# EAGLE design OGX360I-2CH - USB PCB (EAGLE 9.6.2)
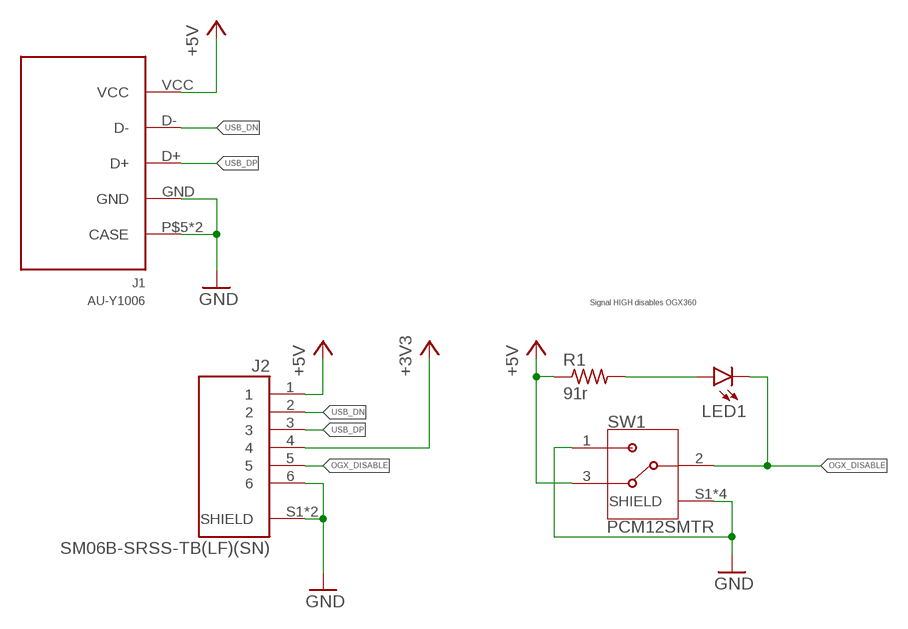
[diagram p0: schematic, sheet 1]

## Parts
J1  AU-Y1006  [USBA_SMD]
J2  SM06B-SRSS-TB(LF)(SN)  [JST_SM06B-SRSS-TB(LF)(SN)]
LED1  LEDCHIP-LED0805  [CHIP-LED0805]
R1  91r  R-US_R0805  [R0805]
SW1  PCM12SMTR  [SW_PCM12SMTR]

## Nets
+3V3: J2.4
+5V: J1.VCC J2.1 R1.1 SW1.3
GND: J1.GND J1.P$5(CASE) J1.P$6(CASE) J2.6 J2.S1(SHIELD) J2.S2(SHIELD) SW1.1 SW1.S1(SHIELD) SW1.S2(SHIELD) SW1.S3(SHIELD) SW1.S4(SHIELD)
N$1: LED1.A R1.2
OGX_DISABLE: J2.5 LED1.C SW1.2
USB_DN: J1.D- J2.2
USB_DP: J1.D+ J2.3

## Notes on the sheet
- Signal HIGH disables OGX360

## Library data of the parts
J1 = AU-Y1006:AU-Y1006: USB - A USB 1.1 Receptacle Connector 4 Position Surface Mount, Right Angle; AVAILABILITY: Unavailable; DESCRIPTION: USB-A _USB TYPE-A_ USB 2.0 Receptacle Connector 4 Position Surface Mount, Right Angle; MF: Assmann WSW; MP: AU-Y1006; PACKAGE: None; PRICE: None
J2 = SM06B-SRSS-TB_LF__SN_:SM06B-SRSS-TB(LF)(SN): SH Series 6 Position 1 mm Surface Mount Right Angle Side Entry Shrouded Header; DESCRIPTION: Connector Header Surface Mount, Right Angle 6 position 0.039 _1.00mm_; DIGI-KEY_PART_NUMBER: 455-1806-1-ND; DIGI-KEY_PURCHASE_URL: https://www.digikey.com/product-detail/en/jst-sales-america-inc/SM06B-SRSS-TB_LF__SN_/455-1806-1-ND/926877?utm_source=snapeda&utm_medium=aggregator&utm_campaign=symbol; MF: JST Sales; MP: SM06B-SRSS-TB_LF__SN_; PACKAGE: None
LED1 = led:LED: LED OSRAM: - CHIPLED LG R971, LG N971, LY N971, LG Q971, LY Q971, LO R971, LY R971 LH N974, LH R974 LS Q976, LO Q976, LY Q976 LO Q996 - Hyper CHIPLED LW Q18S LB Q993, LB Q99A, LB R99A - SideLED LS A670, LO A670, LY A670, LG A670, LP A670 LB A673, LV A673, LT A673, LW A673 LH A674 LY A675 LS A676, LA A676, LO A676, LY A676, LW A676 LS A679, LY A679, LG A679 - Hyper Micro SIDELED® LS Y876, LA Y876, LO Y876, LY Y876 LT Y87S - SmartLED LW L88C, LW L88S LB L89C, LB L89S, LG L890 LS L89K, LO L89K, LY L89K LS L896, LA L896, LO L896, LY L896 - TOPLED LS T670, LO T670, LY T670, LG T670, LP T670 LSG T670, LSP T670, LSY T670, LOP T670, LYG T670 LG T671, LOG T671, LSG T671 LB T673, LV T673, LT T673, LW T673 LH T674 LS T676, LA T676, LO T676, LY T676, LB T676, LH T676, LSB T676, LW T676 LB T67C, LV T67C, LT T67C, LS T67K, LO T67K, LY T67K, LW E67C LS E67B, LA E67B, LO E67B, LY E67B, LB E67C, LV E67C, LT E67C LW T67C LS T679, LY T679, LG T679 LS T770, LO T770, LY T770, LG T770, LP T770 LB T773, LV T773, LT T773, LW T773 LH T774 LS E675, LA E675, LY E675, LS T675 LS T776, LA T776, LO T776, LY T776, LB T776 LHGB T686 LT T68C, LB T68C - Hyper Mini TOPLED® LB M676 - Mini TOPLED Santana® LG M470 LS M47K, LO M47K, LY M47K Source: http://www.osram.convergy.de LUXEON: - LUMILED® LXK2-PW12-R00, LXK2-PW12-S00, LXK2-PW14-U00, LXK2-PW14-V00 LXK2-PM12-R00, LXK2-PM12-S00, LXK2-PM14-U00 LXK2-PE12-Q00, LXK2-PE12-R00, LXK2-PE12-S00, LXK2-PE14-T00, LXK2-PE14-U00 LXK2-PB12-K00, LXK2-PB12-L00, LXK2-PB12-M00, LXK2-PB14-N00, LXK2-PB14-P00, LXK2-PB14-Q00 LXK2-PR12-L00, LXK2-PR12-M00, LXK2-PR14-Q00, LXK2-PR14-R00 LXK2-PD12-Q00, LXK2-PD12-R00, LXK2-PD12-S00 LXK2-PH12-R00, LXK2-PH12-S00 LXK2-PL12-P00, LXK2-PL12-Q00, LXK2-PL12-R00 Source: www.luxeon.com KINGBRIGHT: KA-3528ASYC Source: www.kingbright.com
R1 = rcl:R-US_: RESISTOR, American symbol; SPICEPREFIX: R
SW1 = PCM12SMTR:PCM12SMTR: Switch Slide ON ON SPDT Side Slide 0.3A 6VDC 10000Cycles Gull Wing SMD T/R; DESCRIPTION: Slide Switch SPDT Surface Mount, Right Angle; DIGI-KEY_PART_NUMBER: 401-2016-1-ND; DIGI-KEY_PURCHASE_URL: https://www.digikey.com/product-detail/en/c-k/PCM12SMTR/401-2016-1-ND/1640125?utm_source=snapeda&utm_medium=aggregator&utm_campaign=symbol; MF: C&K; MP: PCM12SMTR; PACKAGE: DO-201 C&amp;K Components

## Board
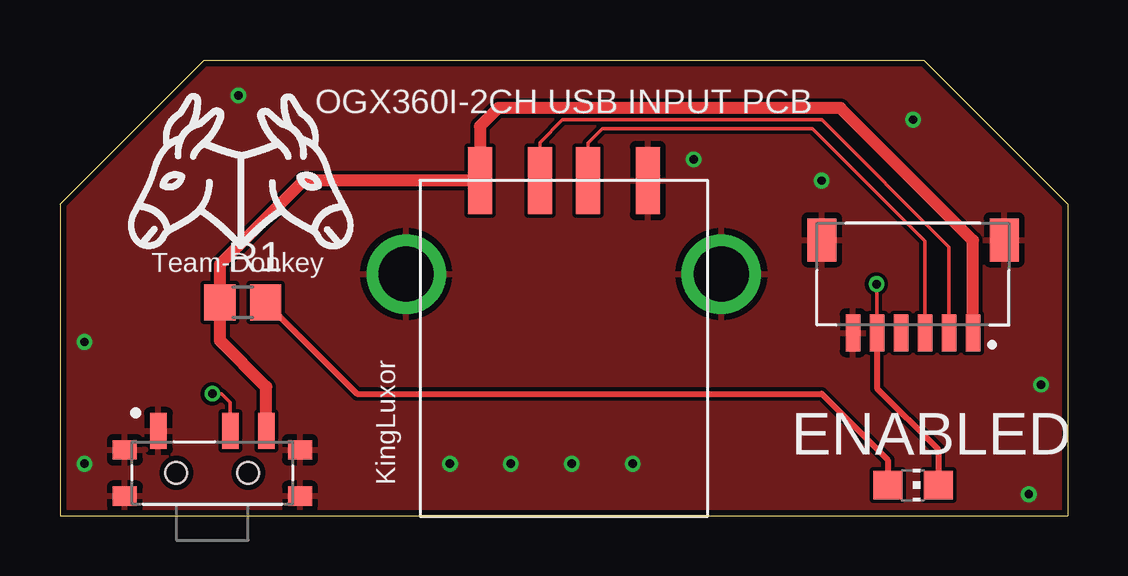
[diagram p1: board, top side]
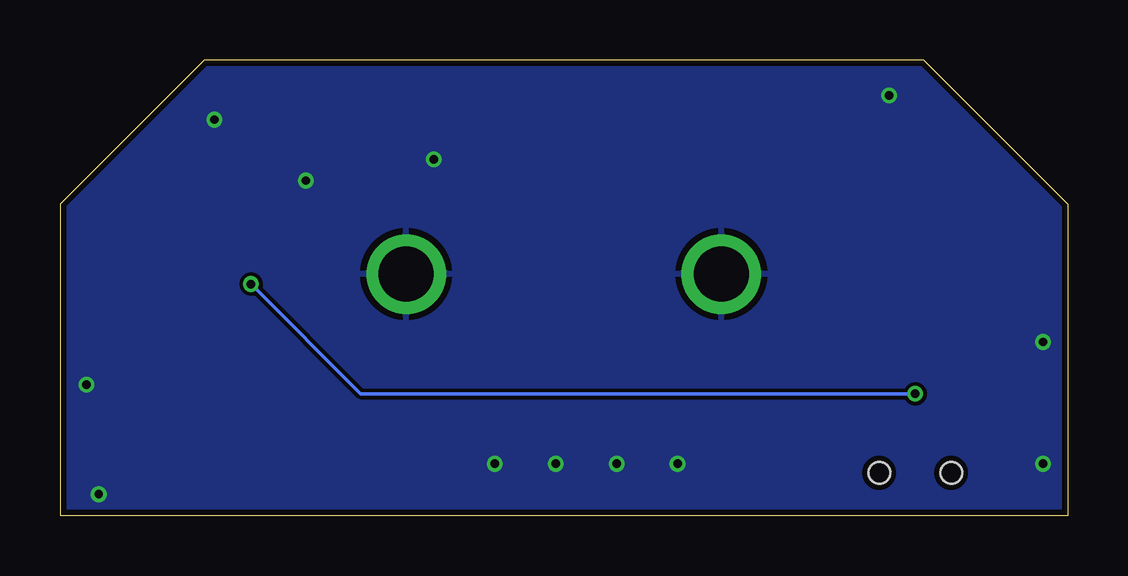
[diagram p2: board, bottom side, seen from below]

Size 42 x 19 mm. Coordinates in mm from the lower left corner, seen from the top.
Outline: 0,0 42,0 42,13 36,19 6,19 0,13 0,0
Copper layers (1*16): Top 0.035mm / dielectric 0.15mm / Bottom 0.035mm
Design rules "default": minimum track width 6mil, minimum drill 12mil, track to track 6mil, track to pad 6mil, pad to pad 6mil, via to via 6mil, smd to smd 0mil, copper to edge 10mil, drill to drill 10mil, minimum pad ring 10mil, minimum via ring 6mil, stop-mask expansion 2mil, vias tented up to drill 100mil, thermal gap 10mil

### Footprints (pad centres in the part's own frame; a part is rotated, then mirrored left to right if it is on the bottom)
USBA_SMD = smd 1 x 2.8: D+ 1,0; D- -1,0; GND 3.5,0; VCC -3.5,0 | drill 2.3: P$5 6.57,-3.9; P$6 -6.57,-3.9
JST_SM06B-SRSS-TB(LF)(SN) = smd 0.6 x 1.55: 1 -2.5,0; 2 -1.5,0; 3 -0.5,0; 4 0.5,0; 5 1.5,0; 6 2.5,0 | smd 1.2 x 1.8: S1 -3.8,-3.875; S2 3.8,-3.875
CHIP-LED0805 = smd 1.2 x 1.2: A 0,-1.05; C 0,1.05
R0805 = smd 1.3 x 1.5: 1 -0.95,0; 2 0.95,0
SW_PCM12SMTR = smd 0.7 x 1.5: 1 -2.25,1.75; 2 0.75,1.75; 3 2.25,1.75 | smd 1 x 0.8: S1 -3.65,0.965; S2 -3.65,-0.965; S3 3.65,-0.965; S4 3.65,0.965 | hole 0.9: -1.5,0; 1.5,0

### Placement (x,y rotation side)
J1  21,13.97 0 top
J2  35.56,7.62 180 top
LED1  35.56,1.27 270 top
R1  7.62,8.89 0 top
SW1  6.35,1.78 0 top

### Tracks (layer width: path | path; a pad name or v marks a point on that pad's centre or on a via)
+5V
  Top 0.508: J2.1 38.06,11.47 32.54,16.99 18.26,16.99 17.5,16.23 J1.VCC 10.16,13.97 6.67,10.48 R1.1 6.67,7.3 8.6,5.37 SW1.3
GND  (via drill 0.35)
  other vias: 7.44,17.53 35.56,16.51 31.75,13.97 26.42,14.86 16.26,2.16 18.8,2.16 21.34,2.16 23.88,2.16 1.02,2.16 1.02,7.24 40.39,0.89 40.89,5.46
  pour Top: -2.54,-1.27 -2.54,20.32 44.45,20.32 44.45,-1.27
  pour Bottom: -3.81,21.59 45.72,21.59 45.72,-2.54 -3.81,-2.54
N$1
  Top 0.254: R1.2 12.38,5.08 31.75,5.08 34.51,2.32 LED1.A
OGX_DISABLE  (via drill 0.35)
  Top 0.152: J2.5 34.06,9.63 v34.04,9.65 | v6.35,5.08 6.73,5.08 7.1,4.71 SW1.2
  Top 0.254: J2.5 34.06,5.31 36.61,2.76 LED1.C
  Bottom 0.152: v34.04,9.65 29.46,5.08 v6.35,5.08
USB_DN
  Top 0.152: J2.2 37.06,11.2 31.75,16.51 20.95,16.51 20,15.55 J1.D-
USB_DP
  Top 0.152: J2.3 36.06,11.44 31.37,16.13 22.61,16.13 22,15.52 J1.D+

### Text on the board
tPlace: OGX360I-2CH USB INPUT PCB | Team-Donkey | ENABLED | KingLuxor